# Altium schematic sheet BTL-TKHT do.SchDoc
size A4
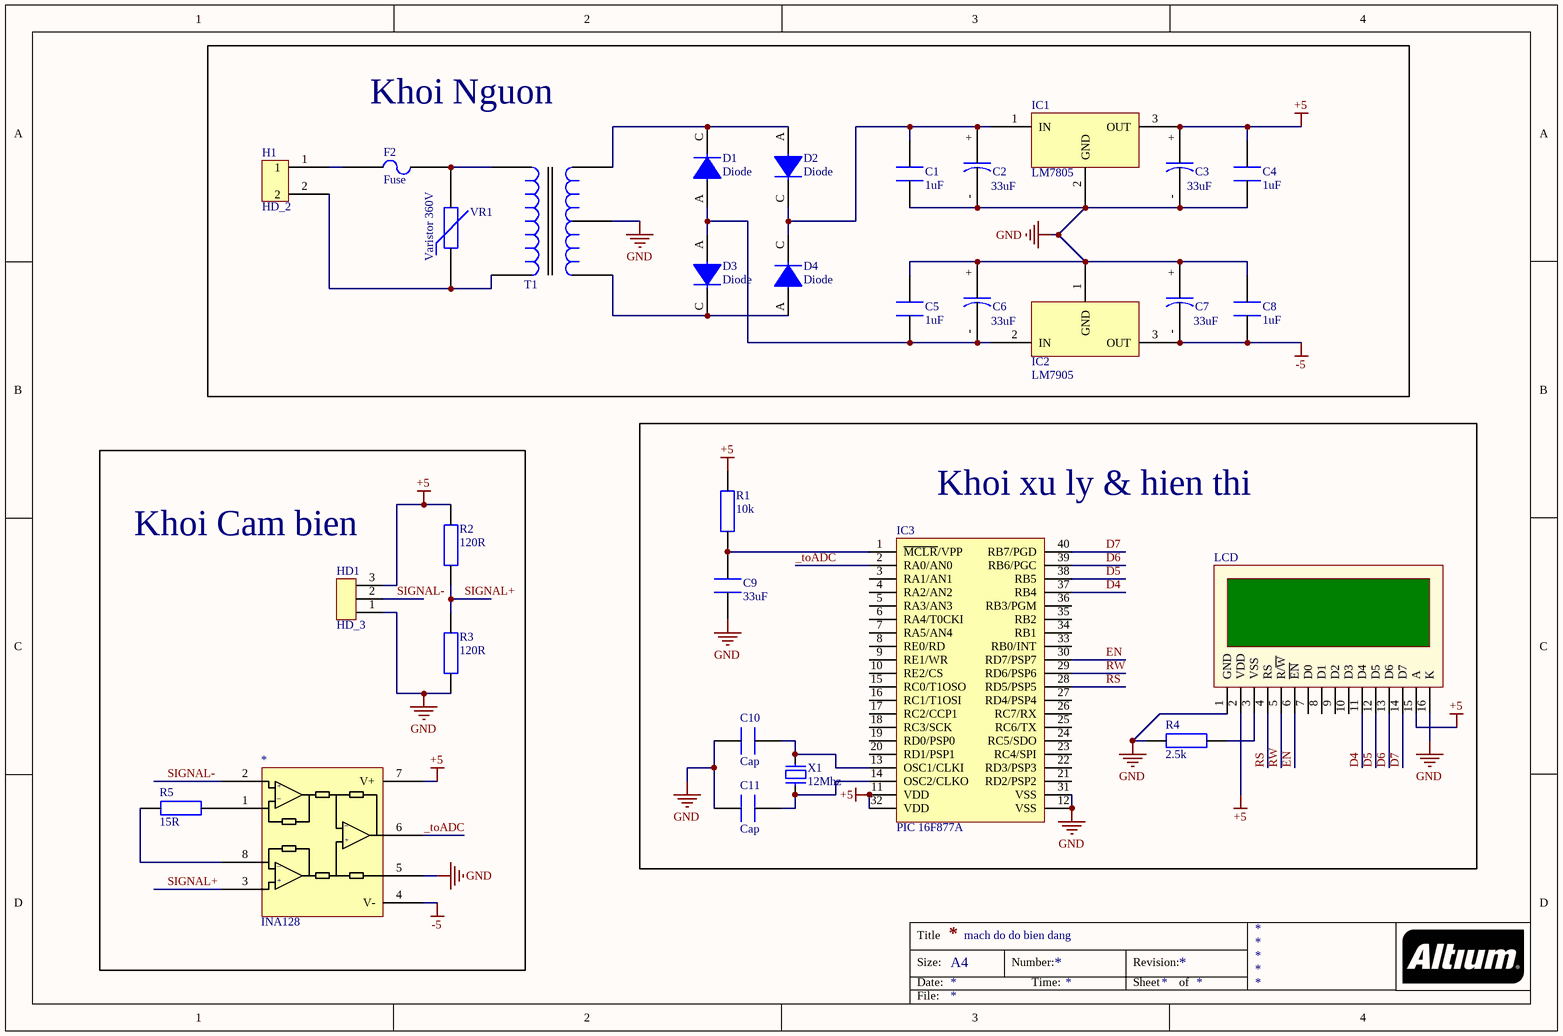
[diagram p0: BTL-TKHT do.SchDoc]

## Parts
*  INA128  [INA128]
C1  1uF  [Cap]
C2  33uF  [POL_160mil]
C3  33uF  [POL_160mil]
C4  1uF  [Cap]
C5  1uF  [Cap]
C6  33uF  [POL_160mil]
C7  33uF  [POL_160mil]
C8  1uF  [Cap]
C9  33uF  [Cap]
C10  Cap  [Cap]
C11  Cap  [Cap]
D1  Diode  [Diode]
D2  Diode  [Diode]
D3  Diode  [Diode]
D4  Diode  [Diode]
F2  Fuse  [PUSE_3]
H1  HD_2  [Header 2]
HD1  HD_3  [HEADER_3]
IC1  LM7805  [LM7805]
IC2  LM7905  [LM7905]
IC3  PIC 16F877A  [DIP40/W0.6]
LCD  LCD 20x4A  [LCD20X4A]  (value not drawn)
R1  10k  [RES]
R2  120R  [RES]
R3  120R  [RES]
R4  2.5k  [RES]
R5  15R  [RES]
T1  Transformer 2P3S  [Transformer_3]  (value not drawn)
VR1  Varistor 360V  [VARISTOR]
X1  12Mhz  [XT2]

## Blocks framed on the sheet
Khoi Nguon: C1-C8 D1-D4 F2 H1 IC1 IC2 T1 VR1
Khoi Cam bien: * HD1 R2 R3 R5
Khoi xu ly & hien thi: C9-C11 IC3 LCD R1 R4 X1

## Nets
+5: *.7(V+) C3.+ C4.2 HD1.3 IC1.3(OUT) IC3.11(VDD) IC3.32(VDD) LCD.2(VDD) LCD.15(A) R1.2 R2.2
-5: *.4(V-) C7.- C8.1 IC2.3(OUT)
GND: *.5 C1.1 C2.- C3.- C4.1 C5.2 C6.+ C7.+ C8.2 C9.1 C10.1 C11.1 HD1.1 IC1.2(GND) IC2.1(GND) IC3.12(VSS) IC3.31(VSS) LCD.1(GND) LCD.16(K) R3.1 R4.2 T1.5
_toADC: *.6 IC3.2(RA0/AN0)
D4: IC3.37(RB4) LCD.11(D4)
D5: IC3.38(RB5) LCD.12(D5)
D6: IC3.39(RB6/PGC) LCD.13(D6)
D7: IC3.40(RB7/PGD) LCD.14(D7)
EN: IC3.30(RD7/PSP7) LCD.6(~{EN})
RS: IC3.28(RD5/PSP5) LCD.4(RS)
RW: IC3.29(RD6/PSP6) LCD.5(R/~{W})
SIGNAL+: *.3 R2.1 R3.2
SIGNAL-: *.2 HD1.2
Net*_1: *.1 R5.2
Net*_8: *.8 R5.1
NetC1_2: C1.2 C2.+ D2.C D4.C IC1.1(IN)
NetC5_1: C5.1 C6.- D1.A D3.A IC2.2(IN)
NetC9_2: C9.2 IC3.1(~{MCLR}/VPP) R1.1
NetC10_2: C10.2 IC3.13(OSC1/CLKI) X1.2
NetC11_2: C11.2 IC3.14(OSC2/CLKO) X1.1
NetD1_C: D1.C D2.A T1.4
NetD3_C: D3.C D4.A T1.6
NetF2_1: F2.1 H1.1
NetF2_2: F2.2 T1.1 VR1.1
NetH1_2: H1.2 T1.3 VR1.2
NetLCD_3: LCD.3(VSS) R4.1

Not connected (* = marked no-connect by the designer): IC3 3(RA1/AN1) 4(RA2/AN2) 5(RA3/AN3) 6(RA4/T0CKI) 7(RA5/AN4) 8(RE0/RD) 9(RE1/WR) 10(RE2/CS) 15(RC0/T1OSO) 16(RC1/T1OSI) 17(RC2/CCP1) 18(RC3/SCK) 19(RD0/PSP0) 20(RD1/PSP1) 21(RD2/PSP2) 22(RD3/PSP3) 23(RC4/SPI) 24(RC5/SDO) 25(RC6/TX) 26(RC7/RX) 27(RD4/PSP4) 33(RB0/INT) 34(RB1) 35(RB2) 36(RB3/PGM); LCD 7(D0) 8(D1) 9(D2) 10(D3)

## Notes on the sheet
- mach do do bien dang
- Title
- Size:
- Date:
- A4
- Number:
- Time:
- Revision:
- Sheet
- of
- File:
- (in symbol INA128) +; _

## Library data of the parts
C1 C4 C5 C8 C9 = Cap
C2 C3 C6 C7 = Pol-Cap: Tụ điện phân cực
IC1 = LM7805: Input Voltage: 7 - 35V, Ouput Voltage: 5V
IC2 = LM7905: Input Voltage: -7 - 35V, Ouput Voltage: -5V
IC3 = PIC16F877-PU: 8K FLASH, 368B RAM, 256B EFROM; Value: DIP 40; Value: PIC16F877A; Copyright by: VanDungEvn
LCD = LCD20x4A: LCD dipslay 20 char, 4 line; Value: Jum 40; Value: LCD 20x4A
R1-R5 = RES: điện trở size nhỏ
VR1 = Varistor
X1 = XT2: Crystal, 32.768 KHz, -40 to 85 degC, 3.2 x 1.5 x 0.9 mm SMD; Value: 4Mhz